# Altium schematic sheet kijek_d.SchDoc
size A4; PageSetup: Record=PageOptions|CenterHorizontal=True|CenterVertical=True|PrintScale=0.98|XCorrection=1.00|YCorrection=1.00|PrintKind=0|BorderSize=5000000|LeftOffset=0|BottomOffset=0|Orientation=2|PaperLength=1000|PaperWidth=1000|Scale=100|PaperSource=7|PrintQuality=-4|MediaType=1|DitherType=10|PaperKind=A4|PrintScaleMode=1
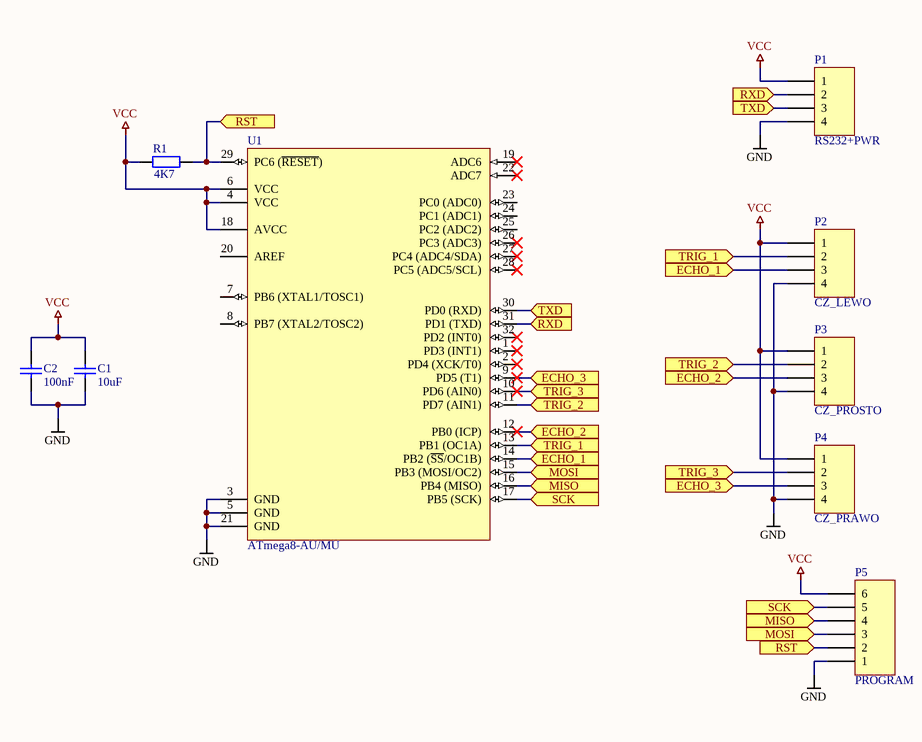
[diagram p0: kijek_d.SchDoc]

## Parts
C1  10uF  [C0603]
C2  100nF  [C0402]
P1  RS232+PWR  [MA04-1]
P2  CZ_LEWO  [MA04-1]
P3  CZ_PROSTO  [MA04-1]
P4  CZ_PRAWO  [MA04-1]
P5  PROGRAM  [SMA06-1]
R1  4K7  [R0402]
U1  ATmega8-AU/MU  [TQFP-32A]

## Ports
ECHO_1, ECHO_2, ECHO_3, MISO, MOSI, RST, RXD, SCK, TRIG_1, TRIG_2, TRIG_3, TXD

## Nets
GND: C1.2 C2.2 P1.4 P2.4 P3.4 P4.4 P5.1 U1.3(GND) U1.5(GND) U1.21(GND)
VCC: C1.1 C2.1 P1.1 P2.1 P3.1 P4.1 P5.6 R1.1 U1.4(VCC) U1.6(VCC) U1.18(AVCC)
ECHO_1: P2.3 U1.14(PB2_(~{SS}/OC1B)) ; port ECHO_1
ECHO_2: P3.3 U1.12(PB0_(ICP)) ; port ECHO_2
ECHO_3: P4.3 U1.9(PD5_(T1)) ; port ECHO_3
MISO: P5.4 U1.16(PB4_(MISO)) ; port MISO
MOSI: P5.3 U1.15(PB3_(MOSI/OC2)) ; port MOSI
RST: P5.2 R1.2 U1.29(PC6_(~{RESET})) ; port RST
RXD: P1.2 U1.31(PD1_(TXD)) ; port RXD
SCK: P5.5 U1.17(PB5_(SCK)) ; port SCK
TRIG_1: P2.2 U1.13(PB1_(OC1A)) ; port TRIG_1
TRIG_2: P3.2 U1.11(PD7_(AIN1)) ; port TRIG_2
TRIG_3: P4.2 U1.10(PD6_(AIN0)) ; port TRIG_3
TXD: P1.3 U1.30(PD0_(RXD)) ; port TXD

Not connected (* = marked no-connect by the designer): U1 1(PD3_(INT1))* 2(PD4_(XCK/T0))* 7(PB6_(XTAL1/TOSC1)) 8(PB7_(XTAL2/TOSC2)) 19(ADC6)* 20(AREF) 22(ADC7)* 23(PC0_(ADC0)) 24(PC1_(ADC1)) 25(PC2_(ADC2)) 26(PC3_(ADC3))* 27(PC4_(ADC4/SDA))* 28(PC5_(ADC5/SCL))* 32(PD2_(INT0))*

## Library data of the parts
C1 C2 = Cap: Capacitor
P1-P4 = Header 4: Header, 4-Pin
P5 = Header 6: Header, 6-Pin
R1 = Res: Resistor
U1 = ATmega8-AU/MU: TQFP - 32pin / MLF - 32pin; DatasheetVersion: revZ, Feb-2011; PackageVersion: revC, Oct-2010; PackageReference: 32A; PackageDescription: 32-Lead, 7x7x1.0 mm Body, 0.8mm Lead Pitch, Thin Profile Plastic Quad Flat Package (TQFP); Code_JEDEC: MS-026-ABA; ComponentLink1Description: Manufacturer URL; ComponentLink1URL: http://www.atmel.com/; ComponentLink2Description: ATmega8(L); ComponentLink2URL: http://www.atmel.com/dyn/resources/prod_documents/doc2486.pdf; ComponentLink3Description: ATmega8(L) Summary; ComponentLink3URL: http://www.atmel.com/dyn/resources/prod_documents/2486S.pdf